# EAGLE design TrainTracker_V01 (EAGLE 6.5.0)
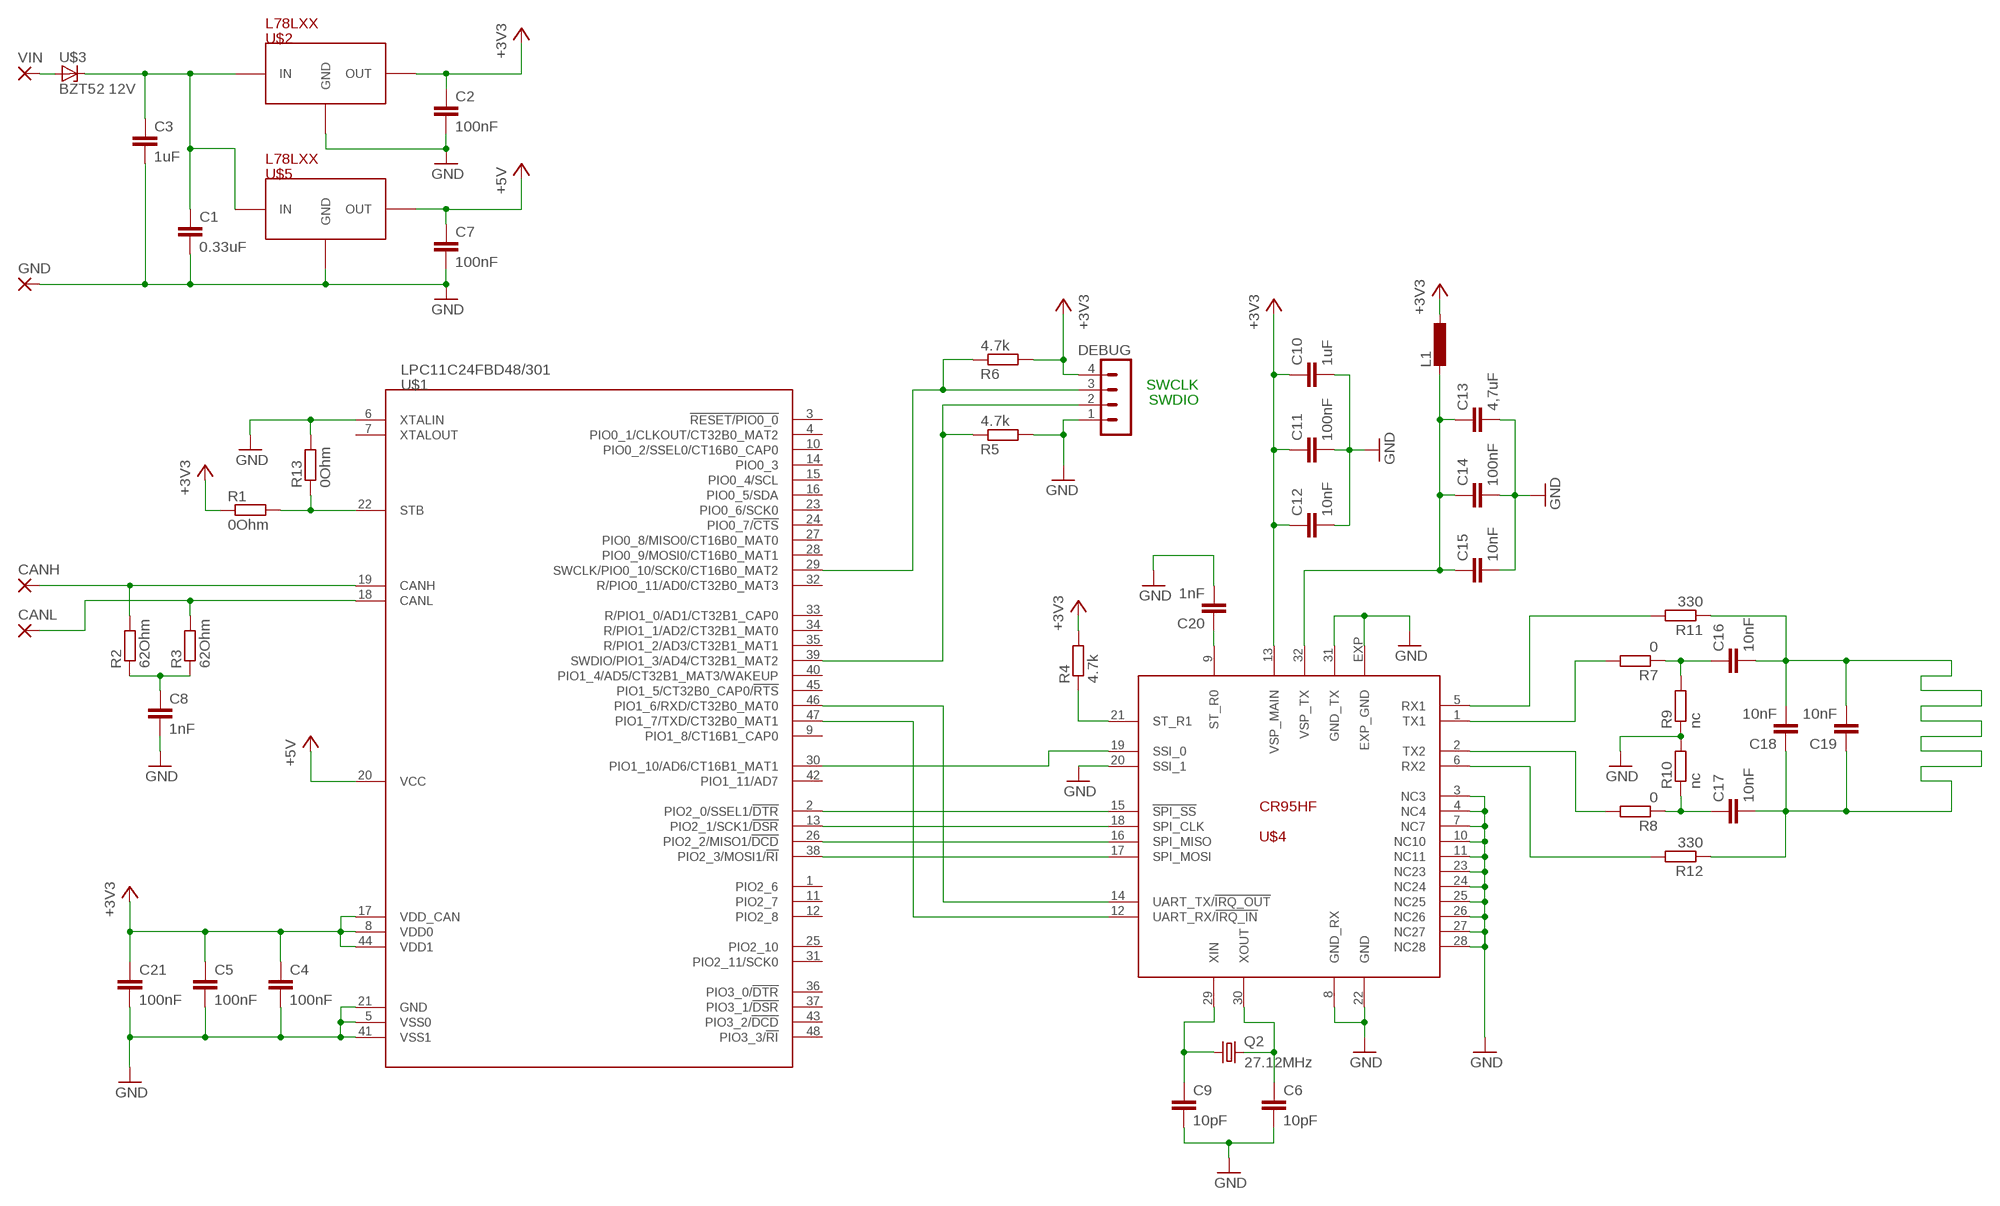
[diagram p0: schematic, sheet 1]

## Parts
C1  0.33uF  C-EUC0402  [C0402]
C2  100nF  C-EUC0402  [C0402]
C3  1uF  C-EUC0603K  [C0603K]
C4  100nF  C-EUC0402  [C0402]
C5  100nF  C-EUC0402  [C0402]
C6  10pF  C-EUC0402  [C0402]
C7  100nF  C-EUC0402  [C0402]
C8  1nF  C-EUC0402  [C0402]
C9  10pF  C-EUC0402  [C0402]
C10  1uF  C-EUC0603K  [C0603K]
C11  100nF  C-EUC0402  [C0402]
C12  10nF  C-EUC0402  [C0402]
C13  4,7uF  C-EUC0603K  [C0603K]
C14  100nF  C-EUC0402  [C0402]
C15  10nF  C-EUC0402  [C0402]
C16  10nF  C-EUC0402  [C0402]
C17  10nF  C-EUC0402  [C0402]
C18  10nF  C-EUC0402  [C0402]
C19  10nF  C-EUC0402  [C0402]
C20  1nF  C-EUC0402  [C0402]
C21  100nF  C-EUC0402  [C0402]
CANH  SMD5  [SMD2,54-5,08]
CANL  SMD5  [SMD2,54-5,08]
DEBUG  MA04-1  [MA04-1]
GND  SMD5  [SMD2,54-5,08]
L1  L-EUL3216C  [L3216C]
Q2  27.12MHz  CRYSTALCTS406  [CTS406]
R1  0Ohm  R-EU_R0402  [R0402]
R2  62Ohm  R-EU_R0402  [R0402]
R3  62Ohm  R-EU_R0402  [R0402]
R4  4.7k  R-EU_R0402  [R0402]
R5  4.7k  R-EU_R0402  [R0402]
R6  4.7k  R-EU_R0402  [R0402]
R7  0  R-EU_R0402  [R0402]
R8  0  R-EU_R0402  [R0402]
R9  nc  R-EU_R0402  [R0402]
R10  nc  R-EU_R0402  [R0402]
R11  330  R-EU_R0402  [R0402]
R12  330  R-EU_R0402  [R0402]
R13  0Ohm  R-EU_R0402  [R0402]
U$1  LPC11C24FBD48/301  [LQFP48]
U$2  L78LXX  [SO8]
U$3  BZT52 12V  BZT52  [SOD123]
U$4  CR95HF  [VFQFPN32]
U$5  L78LXX  [SO8]
VIN  SMD5  [SMD2,54-5,08]

## Nets
+3V3: C2.1 C4.1 C5.1 C10.1 C11.1 C12.1 C21.1 DEBUG.4 L1.1 R1.1 R4.2 R6.2 U$1.8(VDD0) U$1.17(VDD_CAN) U$1.44(VDD1) U$2.1(OUT) U$4.13(VSP_MAIN)
+5V: C7.1 U$1.20(VCC) U$5.1(OUT)
GND: C1.2 C2.2 C3.2 C4.2 C5.2 C6.2 C7.2 C8.2 C9.2 C10.2 C11.2 C12.2 C13.2 C14.2 C15.2 C20.2 C21.2 DEBUG.1 GND.1(P) R5.2 R9.1 R10.2 R13.2 U$1.5(VSS0) U$1.6(XTALIN) U$1.21(GND) U$1.41(VSS1) U$2.2(GND) U$2.3(GND) U$2.6(GND) U$2.7(GND) U$4.3(NC3) U$4.4(NC4) U$4.7(NC7) U$4.8(GND_RX) U$4.10(NC10) U$4.11(NC11) U$4.20(SSI_1) U$4.22(GND) U$4.23(NC23) U$4.24(NC24) U$4.25(NC25) U$4.26(NC26) U$4.27(NC27) U$4.28(NC28) U$4.31(GND_TX) U$4.EXP(EXP_GND) U$5.2(GND) U$5.3(GND) U$5.6(GND) U$5.7(GND)
N$1: U$3.1(A) VIN.1(P)
N$2: C1.1 C3.1 U$2.8(IN) U$3.2(C) U$5.8(IN)
N$3: R1.2 R13.1 U$1.22(STB)
N$4: C8.1 R2.1 R3.1
N$5: CANH.1(P) R2.2 U$1.19(CANH)
N$6: CANL.1(P) R3.2 U$1.18(CANL)
N$7: U$1.2(PIO2_0/SSEL1/!DTR) U$4.15(!SPI_SS)
N$8: C20.1 U$4.9(ST_R0)
N$10: U$1.13(PIO2_1/SCK1/!DSR) U$4.18(SPI_CLK)
N$11: U$1.26(PIO2_2/MISO1/!DCD) U$4.16(SPI_MISO)
N$12: U$1.38(PIO2_3/MOSI1/!RI) U$4.17(SPI_MOSI)
N$13: R4.1 U$4.21(ST_R1)
N$14: U$1.30(PIO1_10/AD6/CT16B1_MAT1) U$4.19(SSI_0)
N$15: U$1.46(PIO1_6/RXD/CT32B0_MAT0) U$4.14(UART_TX/!IRQ_OUT)
N$16: U$1.47(PIO1_7/TXD/CT32B0_MAT1) U$4.12(UART_RX/!IRQ_IN)
N$17: C9.1 Q2.1 U$4.29(XIN)
N$18: C6.1 Q2.3 U$4.30(XOUT)
N$19: C13.1 C14.1 C15.1 L1.2 U$4.32(VSP_TX)
N$20: R11.2 U$4.5(RX1)
N$21: R12.2 U$4.6(RX2)
N$22: R7.2 U$4.1(TX1)
N$23: R8.2 U$4.2(TX2)
N$24: C16.1 R7.1 R9.2
N$25: C17.1 R8.1 R10.1
N$26: DEBUG.2 R5.1 U$1.39(SWDIO/PIO1_3/AD4/CT32B1_MAT2)
N$27: DEBUG.3 R6.1 U$1.29(SWCLK/PIO0_10/SCK0/CT16B0_MAT2)
N$29: C16.2 C17.2 C18.1 C18.2 C19.1 C19.2 R11.1 R12.1
Unconnected: U$1.1(PIO2_6) U$1.3(!RESET/PIO0_0) U$1.4(PIO0_1/CLKOUT/CT32B0_MAT2) U$1.7(XTALOUT) U$1.9(PIO1_8/CT16B1_CAP0) U$1.10(PIO0_2/SSEL0/CT16B0_CAP0) U$1.11(PIO2_7) U$1.12(PIO2_8) U$1.14(PIO0_3) U$1.15(PIO0_4/SCL) U$1.16(PIO0_5/SDA) U$1.23(PIO0_6/SCK0) U$1.24(PIO0_7/!CTS) U$1.25(PIO2_10) U$1.27(PIO0_8/MISO0/CT16B0_MAT0) U$1.28(PIO0_9/MOSI0/CT16B0_MAT1) U$1.31(PIO2_11/SCK0) U$1.32(R/PIO0_11/AD0/CT32B0_MAT3) U$1.33(R/PIO1_0/AD1/CT32B1_CAP0) U$1.34(R/PIO1_1/AD2/CT32B1_MAT0) U$1.35(R/PIO1_2/AD3/CT32B1_MAT1) U$1.36(PIO3_0/!DTR) U$1.37(PIO3_1/!DSR) U$1.40(PIO1_4/AD5/CT32B1_MAT3/WAKEUP) U$1.42(PIO1_11/AD7) U$1.43(PIO3_2/!DCD) U$1.45(PIO1_5/CT32B0_CAP0/!RTS) U$1.48(PIO3_3/!RI)

## Notes on the sheet
- SWCLK
- SWDIO

## Library data of the parts
C1-C21 = rcl:C-EU: CAPACITOR, European symbol
CANH CANL GND VIN = wirepad:SMD5: SMD PAD
DEBUG = con-lstb:MA04-1: PIN HEADER; OC_FARNELL: unknown; OC_NEWARK: unknown
L1 = rcl:L-EU: INDUCTOR, European symbol
Q2 = crystal:CRYSTAL: CRYSTAL; OC_FARNELL: unknown; OC_NEWARK: unknown
R1-R13 = rcl:R-EU_: RESISTOR, European symbol
U$1 = TrainTracker_Library:LPC11C24FBD48/301
U$2 U$5 = TrainTracker_Library:L78LXX
U$3 = TrainTracker_Library:BZT52
U$4 = TrainTracker_Library:CR95HF

## Net classes
0 default: clearance 0.205 mm

## Board
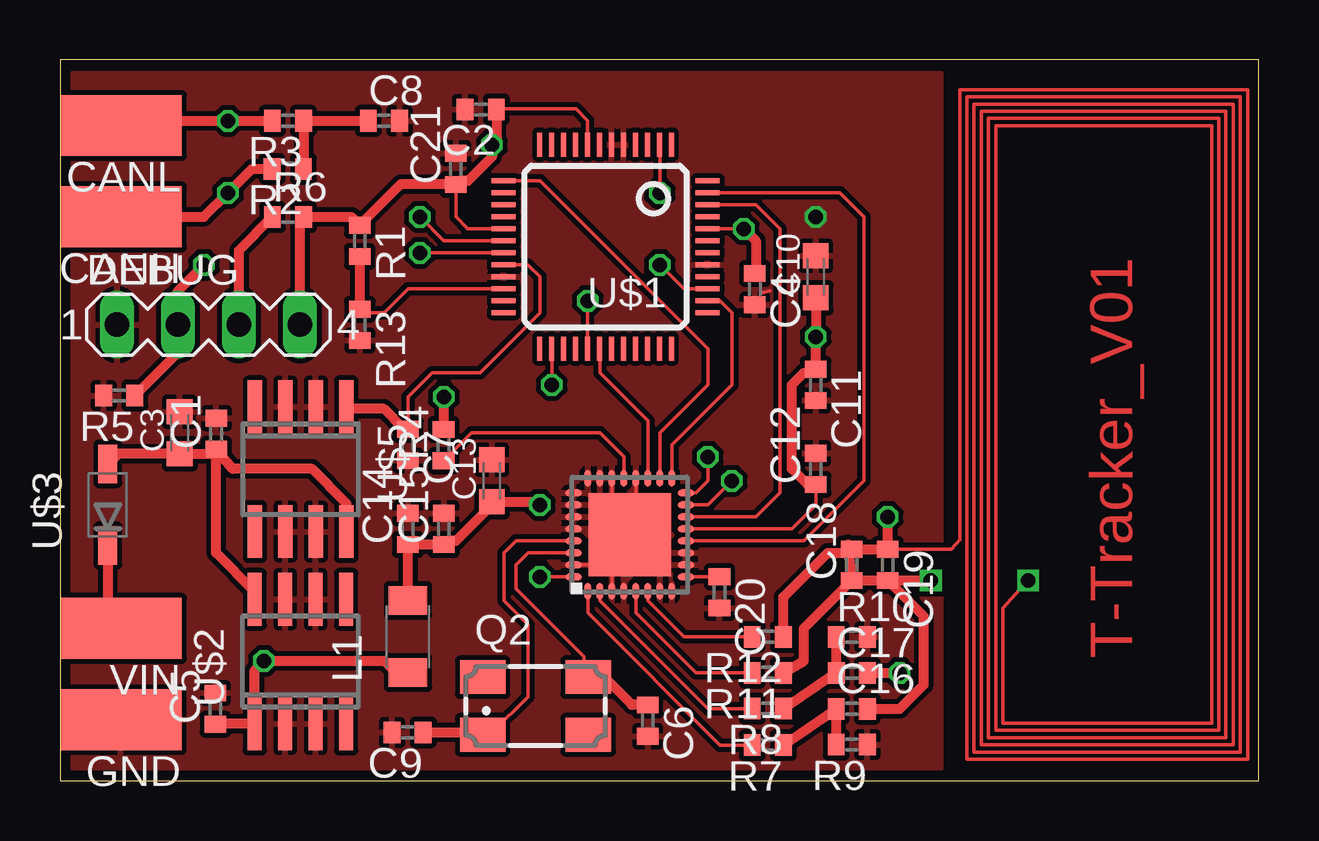
[diagram p1: board, top side]
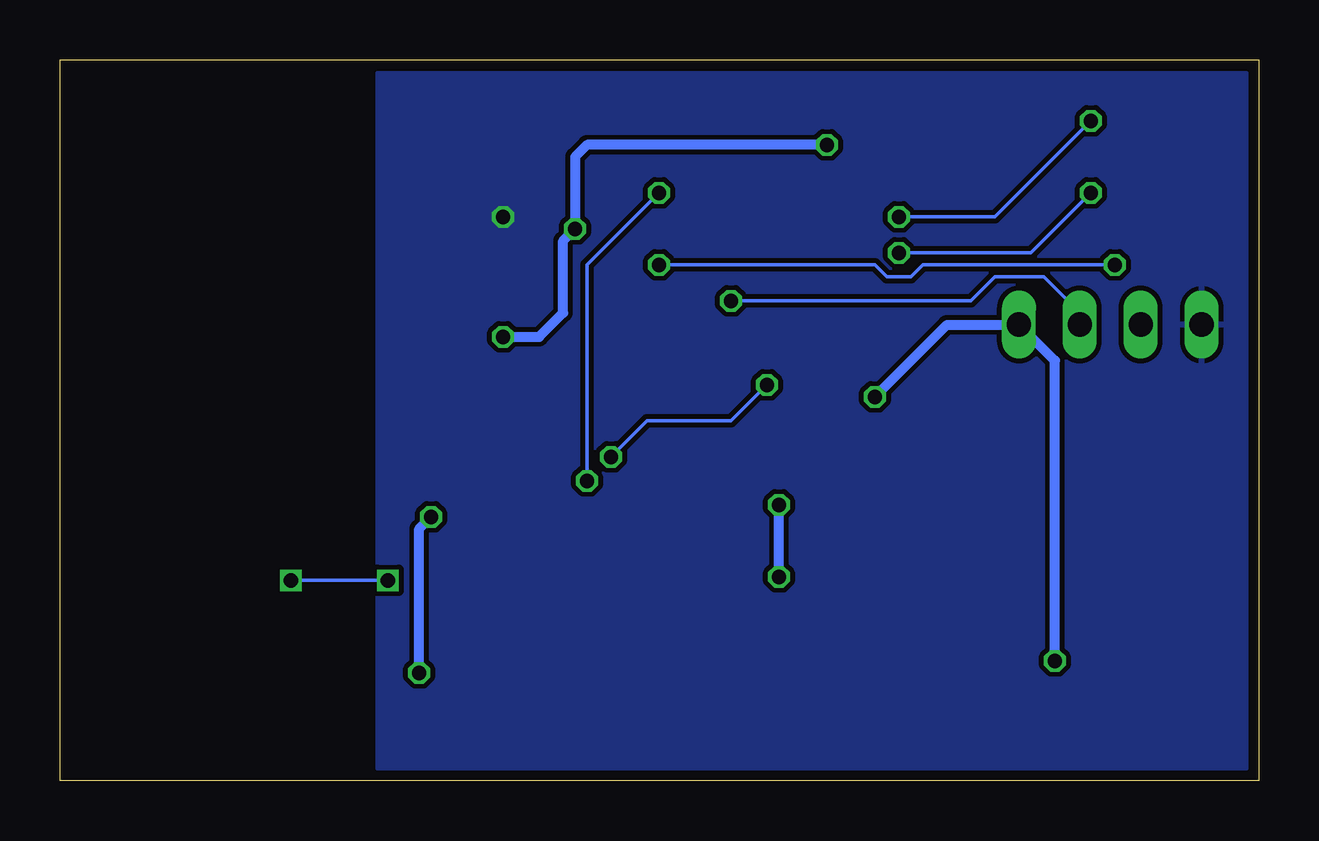
[diagram p2: board, bottom side, seen from below]

Size 49.97 x 30.04 mm. Coordinates in mm from the lower left corner, seen from the top.
Outline: 0,0 49.97,0 49.97,30.04 0,30.04 0,0
Copper layers (1*16): Top 0.035mm / dielectric 1.5mm / Bottom 0.035mm
Design rules "TrainTracker_V01": minimum track width 0.15mm, minimum drill 0.3mm, track to track 0.205mm, track to pad 0.205mm, pad to pad 0.205mm, via to via 0.205mm, smd to smd 0.15mm, copper to edge 0.3mm, drill to drill 0.2mm, minimum pad ring 0.2mm, minimum via ring 0.15mm, stop-mask expansion 0.075mm, vias tented up to drill 0mil, thermal gap 0.2mm

### Footprints (pad centres in the part's own frame; a part is rotated, then mirrored left to right if it is on the bottom)
C0402 = smd 0.7 x 0.9: 1 -0.65,0; 2 0.65,0
C0603K = smd 1.05 x 1.08: 1 -0.875,0; 2 0.875,0
SMD2,54-5,08 = smd 2.54 x 5.08: 1 0,0
MA04-1 = drill 1.016 long: 1 -3.81,0; 2 -1.27,0; 3 1.27,0; 4 3.81,0
L3216C = smd 1.2 x 1.6: 1 -1.5,0; 2 1.5,0
CTS406 = smd 1.9 x 1.4: 1 -2.2,-1.2; 2 2.2,-1.2; 3 2.2,1.2; 4 -2.2,1.2
R0402 = smd 0.7 x 0.9: 1 -0.65,0; 2 0.65,0
LQFP48 = smd 0.2 x 1: 1 -2.75,-4.25; 2 -2.25,-4.25; 3 -1.75,-4.25; 4 -1.25,-4.25; 5 -0.75,-4.25; 6 -0.25,-4.25; 7 0.25,-4.25; 8 0.75,-4.25; 9 1.25,-4.25; 10 1.75,-4.25; 11 2.25,-4.25; 12 2.75,-4.25; 25 2.75,4.25; 26 2.25,4.25; 27 1.75,4.25; 28 1.25,4.25; 29 0.75,4.25; 30 0.25,4.25; 31 -0.25,4.25; 32 -0.75,4.25; 33 -1.25,4.25; 34 -1.75,4.25; 35 -2.25,4.25; 36 -2.75,4.25 | smd 1 x 0.2: 13 4.25,-2.75; 14 4.25,-2.25; 15 4.25,-1.75; 16 4.25,-1.25; 17 4.25,-0.75; 18 4.25,-0.25; 19 4.25,0.25; 20 4.25,0.75; 21 4.25,1.25; 22 4.25,1.75; 23 4.25,2.25; 24 4.25,2.75; 37 -4.25,2.75; 38 -4.25,2.25; 39 -4.25,1.75; 40 -4.25,1.25; 41 -4.25,0.75; 42 -4.25,0.25; 43 -4.25,-0.25; 44 -4.25,-0.75; 45 -4.25,-1.25; 46 -4.25,-1.75; 47 -4.25,-2.25; 48 -4.25,-2.75
SO8 = smd 0.6 x 2.2: 1 -1.905,-2.6; 2 -0.635,-2.6; 3 0.635,-2.6; 4 1.905,-2.6; 5 1.905,2.6; 6 0.635,2.6; 7 -0.635,2.6; 8 -1.905,2.6
SOD123 = smd 1.6 x 0.8: 1 -1.7,0; 2 1.7,0
VFQFPN32 = smd 0.7 x 0.3: 1 -2.35,1.75; 2 -2.35,1.25; 3 -2.35,0.75; 4 -2.35,0.25; 5 -2.35,-0.25; 6 -2.35,-0.75; 7 -2.35,-1.25; 8 -2.35,-1.75; 17 2.35,-1.75; 18 2.35,-1.25; 19 2.35,-0.75; 20 2.35,-0.25; 21 2.35,0.25; 22 2.35,0.75; 23 2.35,1.25; 24 2.35,1.75 | smd 0.3 x 0.7: 9 -1.75,-2.35; 10 -1.25,-2.35; 11 -0.75,-2.35; 12 -0.25,-2.35; 13 0.25,-2.35; 14 0.75,-2.35; 15 1.25,-2.35; 16 1.75,-2.35; 25 1.75,2.35; 26 1.25,2.35; 27 0.75,2.35; 28 0.25,2.35; 29 -0.25,2.35; 30 -0.75,2.35; 31 -1.25,2.35; 32 -1.75,2.35 | smd 3.45 x 3.45: EXP 0,0

### Placement (x,y rotation side)
C1  6.51,14.46 90 top
C2  17.54,27.98 180 top
C3  5,14.51 90 top
C4  28.96,20.49 270 top
C5  6.48,3.01 90 top
C6  24.5,2.51 270 top
C7  14.5,14 270 top
C8  13.5,27.5 0 top
C9  14.49,2.02 180 top
C10  31.5,21 90 top
C11  31.5,16.5 270 top
C12  31.5,13 90 top
C13  18,12.5 90 top
C14  14.5,10.5 90 top
C15  16,10.5 90 top
C16  33,3 0 top
C17  33.01,4.5 0 top
C18  33,9 90 top
C19  34.5,9 270 top
C20  27.49,7.85 270 top
C21  16.5,25.5 90 top
CANH  2.54,23.5 90 top
CANL  2.54,27.3 90 top
DEBUG  6.19,19.01 0 top
GND  2.54,2.54 90 top
L1  14.51,6.01 90 top
Q2  19.82,3.12 0 top
R1  12.49,22.5 270 top
R2  9.49,25.5 180 top
R3  9.5,27.5 180 top
R4  15.99,13.99 90 top
R5  2.47,16.05 180 top
R6  9.5,23.5 0 top
R7  29.5,1.49 180 top
R8  29.5,3.01 180 top
R9  33,1.51 180 top
R10  33,6 0 top
R11  29.5,4.5 180 top
R12  29.5,6 180 top
R13  12.5,19 270 top
U$1  22.74,22.25 180 top
U$2  10.02,4.97 0 top
U$3  2,11.51 90 top
U$4  23.75,10.25 90 top
U$5  10.03,12.98 180 top
VIN  2.54,6.35 90 top

### Tracks (layer width: path | path; a pad name or v marks a point on that pad's centre or on a via)
+3V3  (via drill 0.6)
  Top 0.15: U$4.13 30.5,10.5 31.5,11.5 C12.1 | U$1.8 21.99,27.51 21.5,28 18.21,28 C2.1 | U$1.17 17,23 16.5,23.5 C21.1 | v28.5,23 U$1.44
  Top 0.406: C5.1 U$2.1 8.12,4.62 v8.5,5 13.5,5 14,4.5 14.49,4.5 L1.1 | C12.1 31.15,12.35 30.5,13 30.5,16.5 31,17 31.35,17 C11.1 v31.5,18.5 C10.1 | R4.2 v16,16 | DEBUG.4 10,23.34 R6.2 12.15,23.5 R1.1 14.2,24.85 C21.1 16.65,25 17,25 18,26 v18,26.5 18.19,26.69 C2.1 | v28.5,23 29,22.5 29,21.18 C4.1
  Bottom 0.406: v8.5,5 8.5,17.51 DEBUG.4 13,19 v16,16 | v31.5,18.5 30,18.5 29,19.5 29,22.5 v28.5,23 28.5,26 28,26.5 v18,26.5
+5V
  Top 0.15: U$1.20 19.5,21.5 20,21 20,19.5 17.5,17 15.5,17 14.5,16 C7.1
  Top 0.406: C7.1 14.35,14.65 13.5,15.5 12.02,15.5 U$5.1
GND  (via drill 0.6)
  Top 0.15: U$4.EXP 23.25,10.25 22,9 U$4.31 | U$4.3 23,9.5 23.5,10 | 23.5,10 U$4.EXP | 29.21,20.32 29.58,20.41 | 29.21,20.32 29.58,20.41 | 29.21,20.32 29.58,20.41 | 29.21,20.32 29.58,20.41 | 24,11 U$4.20 24,12 23,11 | 24,11 24,10 24.5,9.5 U$4.EXP | 23,11 23,10.5 23.5,10 | 23.5,10 23.5,10.5 24,11 | 24,11 23,11 | 23,11 U$4.22
  other vias: 31.5,23.5
  pour Top: 0.5,29.5 36.75,29.5 36.75,0.5 0.5,0.5
  pour Bottom: 0.5,29.5 36.75,29.5 36.75,0.5 0.5,0.5
N$1
  Top 0.254: 2.1,7.09 2,7 2,6.89 2.19,6.7 VIN.1
  Top 0.406: U$3.1 2,6.89 2.19,6.7
N$2
  Top 0.406: U$3.2 2.42,13.63 C3.1 6.33,13.63 C1.1 | U$2.8 8.12,7.88 6.5,9.5 6.5,13.79 C1.1 | U$5.8 11.94,11.56 10.5,13 7.21,13 C1.1
N$3
  Top 0.15: U$1.22 14.51,20.5 13.5,19.5 12.65,19.5 R13.1
  Top 0.406: R1.2 R13.1
N$4
  Top 0.406: C8.1 R3.1 R2.1
N$5  (via drill 0.6)
  Top 0.15: U$1.19 17,22 v15,22
  Top 0.406: R2.2 8,25.5 v7,24.5 6,23.5 CANH.1
  Bottom 0.15: v15,22 9.5,22 v7,24.5
N$6  (via drill 0.6)
  Top 0.15: U$1.18 15.99,22.5 v15,23.5
  Top 0.406: CANL.1 2.74,27.5 v7,27.5 R3.2
  Bottom 0.15: v15,23.5 11,23.5 v7,27.5
N$7  (via drill 0.6)
  Top 0.15: U$4.15 27,11.5 v28,12.5 | v25,24.5 U$1.2
  Bottom 0.15: v28,12.5 28,21.5 v25,24.5
N$8
  Top 0.15: U$4.9 C20.1
N$10
  Top 0.15: U$4.18 25,14.5 27,16.5 27,18 20,25 U$1.13
N$11  (via drill 0.6)
  Top 0.15: U$4.16 26.5,12 27,12.5 v27,13.5 | v20.5,16.5 U$1.26
  Bottom 0.15: v27,13.5 25.5,15 22,15 v20.5,16.5
N$12
  Top 0.15: U$4.17 25.5,14 28,16.5 28,19.5 27.5,20 U$1.38
N$13
  Top 0.15: U$4.21 23.5,13.5 22.5,14.5 17.15,14.5 R4.1
N$14
  Top 0.15: U$4.19 24.5,15 22.5,17 U$1.30
N$15
  Top 0.15: U$4.14 29,11 30,12 30,23 29,24 U$1.46
N$16
  Top 0.15: U$4.12 31,10 33.5,12.5 33.5,23.5 32.5,24.5 U$1.47
N$17
  Top 0.15: 17.52,2.02 18.02,2.02 19.5,3.5 19.5,6.5 18.5,7.5 18.5,9.5 19,10 U$4.29
  Top 0.406: C9.1 17.52,2.02 Q2.1
N$18
  Top 0.15: 21.84,4.5 21.84,5.16 19,8 19,9 19.5,9.5 U$4.30
  Top 0.406: 21.84,4.5 Q2.3 22.2,4.5 22.5,4.5 23.84,3.16 C6.1
N$19  (via drill 0.6)
  Top 0.15: U$4.32 v20,8.5
  Top 0.406: C15.1 C14.1 L1.2 | C15.1 15.85,9.85 | v20,11.5 19.88,11.62 C13.1 18,11.5 16.5,10 16.15,10 C15.1
  Bottom 0.406: v20,8.5 v20,11.5
N$20
  Top 0.15: R11.2 26.5,4.5 24,7 U$4.5
N$21
  Top 0.15: R12.2 26,6 24.5,7.5 U$4.6
N$22
  Top 0.15: R7.2 27.51,1.49 22,7 U$4.1
N$23
  Top 0.15: R8.2 27.01,3.01 27,3 22.5,7.5 U$4.2
N$24
  Top 0.406: R9.2 C16.1 R7.1
N$25
  Top 0.406: R8.1 C17.1 R10.1
N$26  (via drill 0.6)
  Top 0.15: U$1.39 26,20.5 v25,21.5
  Top 0.406: 3.12,16.12 R5.1 4.92,17.86 DEBUG.2 4.92,20.42 v6,21.5
  Bottom 0.15: v25,21.5 16,21.5 15.5,21 14.5,21 14,21.5 v6,21.5
N$27  (via drill 0.6)
  Top 0.15: U$1.29 v21.99,19.99 v22,20
  Top 0.406: R6.1 7.46,22.11 DEBUG.3
  Bottom 0.15: v22,20 12,20 11,21 8.96,21 7.46,19.5 DEBUG.3
N$29  (via drill 0.6)
  Top 0.15: v40.35,8.35 39.3,7.2 39.3,2.4 48,2.4 48,27.3 39,27.3 39,2.1 48.3,2.1 48.3,27.6 38.7,27.6 38.7,1.8 48.6,1.8 48.6,27.9 38.4,27.9 38.4,1.5 48.9,1.5 48.9,28.2 38.1,28.2 38.1,1.2 49.2,1.2 49.2,28.5 37.8,28.5 37.8,0.9 49.5,0.9 49.5,28.8 37.5,28.8 37.5,10.05 37.15,9.65 C19.1
  Top 0.406: C18.1 C19.2 | C19.2 v36.3,8.35 | C17.2 v35,4.5 | C16.2 35,3 36,4 36,5.5 36,6.85 C19.2 | C18.1 32.85,9.85 | R11.1 31,5 31,6.35 C18.1 | R12.1 30.15,7.65 32,9.5 32.85,9.5 C18.2 C19.1 v34.5,11
  Bottom 0.15: v40.35,8.35 v36.3,8.35
  Bottom 0.406: v35,4.5 35,10.5 v34.5,11

### Text on the board
Top: T-Tracker_V01